# Altium schematic sheet CON_ATA_25.SchDoc: IDE Connector
size A4; SheetNumber: 1; SheetTotal: 100; Organization: Altium Limited.; Address1: Level 3, 12a Rodborough Rd; Address2: Frenchs Forest 2086; Address3: NSW; Address4: AUSTRALIA
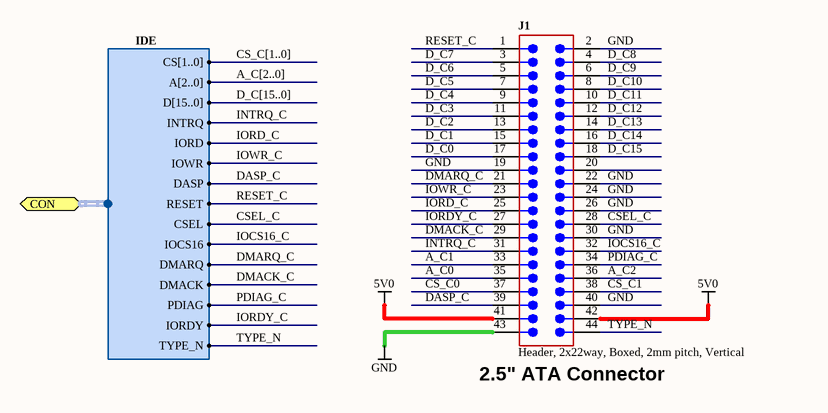
[diagram p0: CON_ATA_25.SchDoc]

## Parts
J1  Header, 2x22way, Boxed, 2mm pitch, Vertical  [HDR2X22-2mm]

## Ports
CON (harness IDE)

## Harnesses
IDE: CS[1..0], A[2..0], D[15..0], INTRQ, IORD, IOWR, DASP, RESET, CSEL, IOCS16, DMARQ, DMACK, PDIAG, IORDY, TYPE_N

## Nets
5V0: J1.41 J1.42
GND: J1.2 J1.19 J1.22 J1.24 J1.26 J1.30 J1.40 J1.43
A_C0: J1.35
A_C1: J1.33
A_C2: J1.36
CS_C0: J1.37
CS_C1: J1.38
CSEL_C: J1.28 ; port CON.CSEL
D_C0: J1.17
D_C1: J1.15
D_C2: J1.13
D_C3: J1.11
D_C4: J1.9
D_C5: J1.7
D_C6: J1.5
D_C7: J1.3
D_C8: J1.4
D_C9: J1.6
D_C10: J1.8
D_C11: J1.10
D_C12: J1.12
D_C13: J1.14
D_C14: J1.16
D_C15: J1.18
DASP_C: J1.39 ; port CON.DASP
DMACK_C: J1.29 ; port CON.DMACK
DMARQ_C: J1.21 ; port CON.DMARQ
INTRQ_C: J1.31 ; port CON.INTRQ
IOCS16_C: J1.32 ; port CON.IOCS16
IORD_C: J1.25 ; port CON.IORD
IORDY_C: J1.27 ; port CON.IORDY
IOWR_C: J1.23 ; port CON.IOWR
PDIAG_C: J1.34 ; port CON.PDIAG
RESET_C: J1.1 ; port CON.RESET
TYPE_N: J1.44 ; port CON.TYPE_N

Not connected (* = marked no-connect by the designer): J1 20

## Buses and harness runs
bus A_C[2..0]
bus CS_C[1..0]
bus D_C[15..0]

## Notes on the sheet
- (near J1) 2.5" ATA Connector
- Title
- Size:
- Date:
- A4
- Number:
- Time:
- Revision:
- Sheet
- of
- File:

## Library data of the parts
J1 = D-300-0004: Max Current: mA; Connector type: Header; Mounting Technology: Through-Hole; Pin Count: 44; Status: Production; Category: Connector